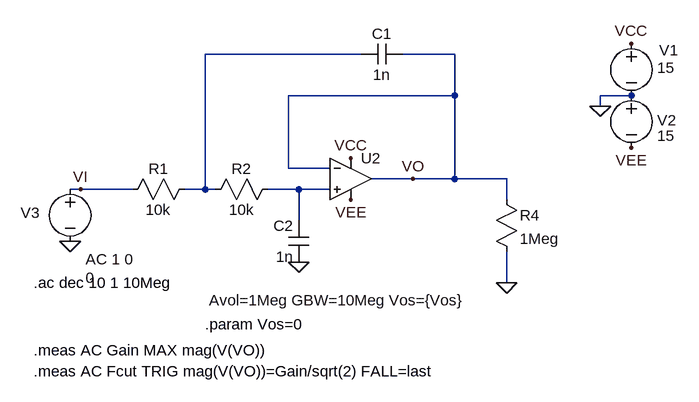
[diagram p0: schematic sallenkey.asc]
sallenkey.asc, the LTspice schematic file:
Version 4
SHEET 1 1160 680
WIRE 448 -256 208 -256
WIRE 592 -256 512 -256
WIRE 592 -192 592 -256
WIRE 592 -192 336 -192
WIRE 864 -192 816 -192
WIRE 816 -176 816 -192
WIRE 336 -80 336 -192
WIRE 400 -80 336 -80
WIRE 528 -64 464 -64
WIRE 592 -64 592 -192
WIRE 592 -64 528 -64
WIRE 672 -64 592 -64
WIRE 16 -48 0 -48
WIRE 96 -48 16 -48
WIRE 208 -48 208 -256
WIRE 208 -48 176 -48
WIRE 224 -48 208 -48
WIRE 352 -48 304 -48
WIRE 400 -48 352 -48
WIRE 672 -32 672 -64
WIRE 352 0 352 -48
WIRE 672 96 672 48
FLAG 816 -176 0
FLAG 864 -272 VCC
FLAG 864 -112 VEE
FLAG 0 32 0
FLAG 16 -48 VI
FLAG 528 -64 VO
FLAG 672 96 0
FLAG 352 64 0
FLAG 432 -32 VEE
FLAG 432 -96 VCC
SYMBOL voltage 864 -288 R0
WINDOW 0 43 26 Left 2
WINDOW 3 40 53 Left 2
WINDOW 123 0 0 Left 2
WINDOW 39 0 0 Left 2
SYMATTR InstName V1
SYMATTR Value 15
SYMBOL voltage 864 -208 R0
WINDOW 0 40 54 Left 2
WINDOW 3 40 78 Left 2
WINDOW 123 0 0 Left 2
WINDOW 39 0 0 Left 2
SYMATTR InstName V2
SYMATTR Value 15
SYMBOL res 320 -64 R90
WINDOW 0 0 56 VBottom 2
WINDOW 3 32 56 VTop 2
SYMATTR InstName R2
SYMATTR Value 10k
SYMBOL res 192 -64 R90
WINDOW 0 0 56 VBottom 2
WINDOW 3 32 56 VTop 2
SYMATTR InstName R1
SYMATTR Value 10k
SYMBOL cap 512 -272 R90
WINDOW 0 0 32 VBottom 2
WINDOW 3 32 32 VTop 2
SYMATTR InstName C1
SYMATTR Value 1n
SYMBOL res 656 -48 R0
SYMATTR InstName R4
SYMATTR Value 1Meg
SYMBOL cap 368 64 R180
WINDOW 0 24 56 Left 2
WINDOW 3 24 8 Left 2
SYMATTR InstName C2
SYMATTR Value 1n
SYMBOL voltage 0 -64 R0
WINDOW 0 -76 52 Left 2
WINDOW 3 24 152 Left 2
WINDOW 123 24 124 Left 2
WINDOW 39 0 0 Left 0
SYMATTR InstName V3
SYMATTR Value 0
SYMATTR Value2 AC 1 0
SYMBOL OpAmps\\UniversalOpAmp 432 -64 R0
WINDOW 123 -218 187 Left 2
SYMATTR InstName U2
SYMATTR Value2 Avol=1Meg GBW=10Meg Vos={Vos}
TEXT -56 96 Left 2 !.ac dec 10 1 10Meg
TEXT -56 200 Left 2 !.meas AC Gain MAX mag(V(VO))
TEXT -56 232 Left 2 !.meas AC Fcut TRIG mag(V(VO))=Gain/sqrt(2) FALL=last
TEXT 208 160 Left 2 !.param Vos=0

The netlist it stands for:
* sallenkey.asc
V1 VCC 0 15
V2 0 VEE 15
R2 N002 N001 10k
R1 N001 VI 10k
C1 VO N001 1n
R4 VO 0 1Meg
C2 0 N002 1n
V3 VI 0 0 AC 1 0
XU2 N002 VO VCC VEE VO level1 Avol=1Meg GBW=10Meg Vos={Vos} En=0 Enk=0 In=0 Ink=0 Rin=500Meg  ; pins In+ In- V+ V- OUT
.ac dec 10 1 10Meg
.meas AC Gain MAX mag(V(VO))
.meas AC Fcut TRIG mag(V(VO))=Gain/sqrt(2) FALL=last
.param Vos=0
.lib UniversalOpAmp1.lib
.backanno
.end